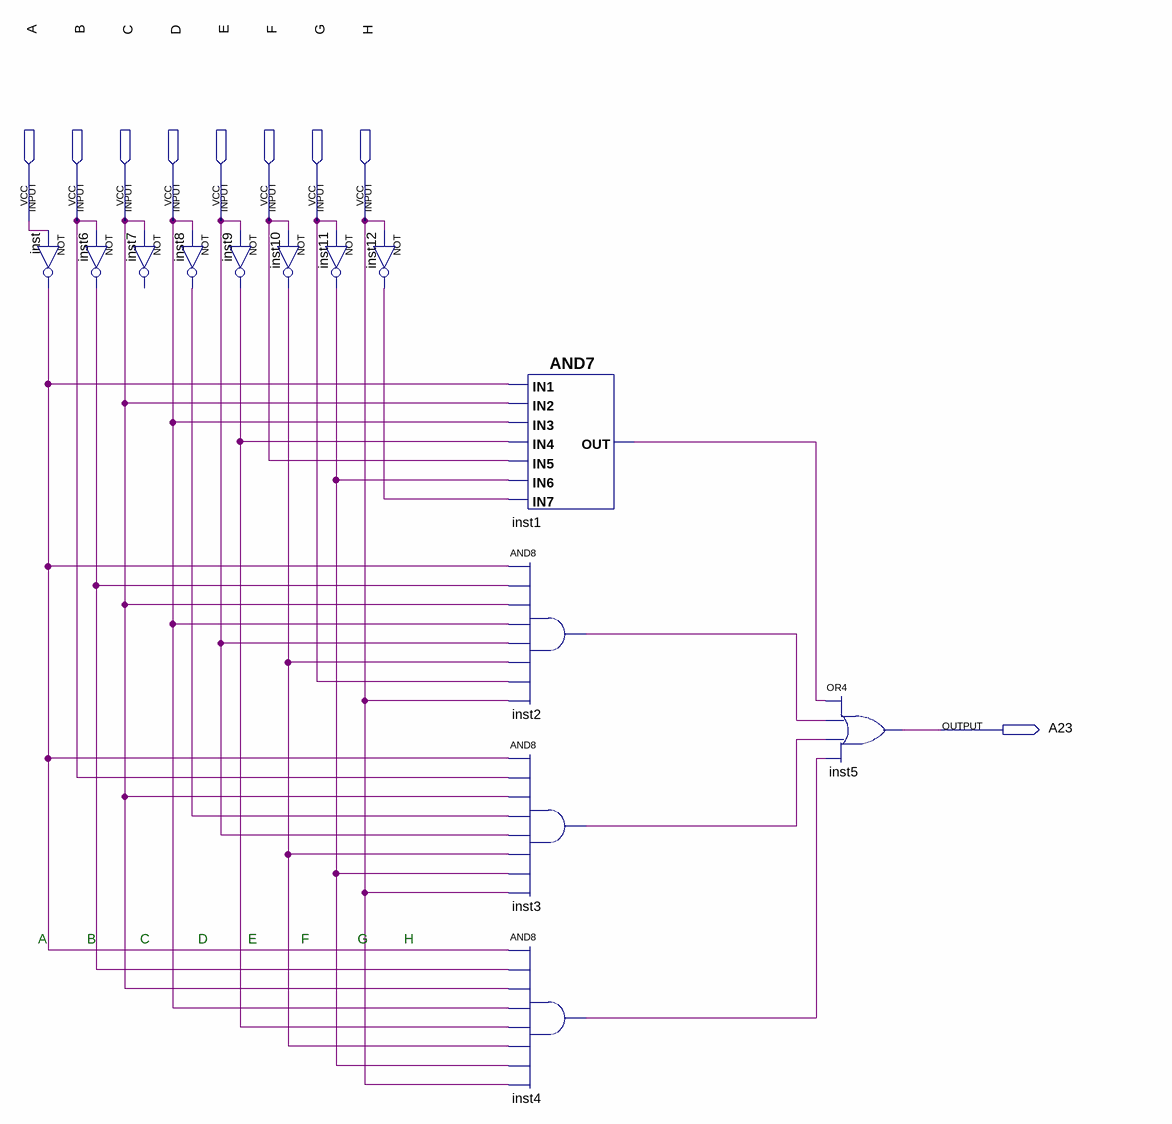
[diagram p0: schematic sheet]
// Quartus schematic A23.bdf as structural Verilog: 13 symbols, 9 pins
module A23 (
  input  A,
  input  B,
  input  C,
  input  D,
  input  E,
  input  F,
  input  G,
  input  H,
  output A23
);

  wire inst1_out, inst2_out, inst3_out, inst4_out, inst6_out, inst8_out, inst9_out, inst10_out, inst11_out,
       inst12_out, inst_out;

  not inst (inst_out, A);
  not inst6 (inst6_out, B);
  // NOT inst7 has open pins: IN=C, OUT=open
  not inst8 (inst8_out, D);
  not inst9 (inst9_out, E);
  not inst10 (inst10_out, F);
  not inst11 (inst11_out, G);
  not inst12 (inst12_out, H);
  and inst1 (inst1_out, inst_out, C, D, inst9_out, F, inst11_out, inst12_out);
  and inst2 (inst2_out, inst_out, inst6_out, C, D, E, inst10_out, G, H);
  and inst3 (inst3_out, inst_out, B, C, inst8_out, E, inst10_out, inst11_out, H);
  and inst4 (inst4_out, inst_out, inst6_out, C, D, inst9_out, inst10_out, inst11_out, H);
  or inst5 (A23, inst1_out, inst2_out, inst3_out, inst4_out);

  // Notes on the sheet:
  //   A          B           C            D          E           F            G         H
endmodule
